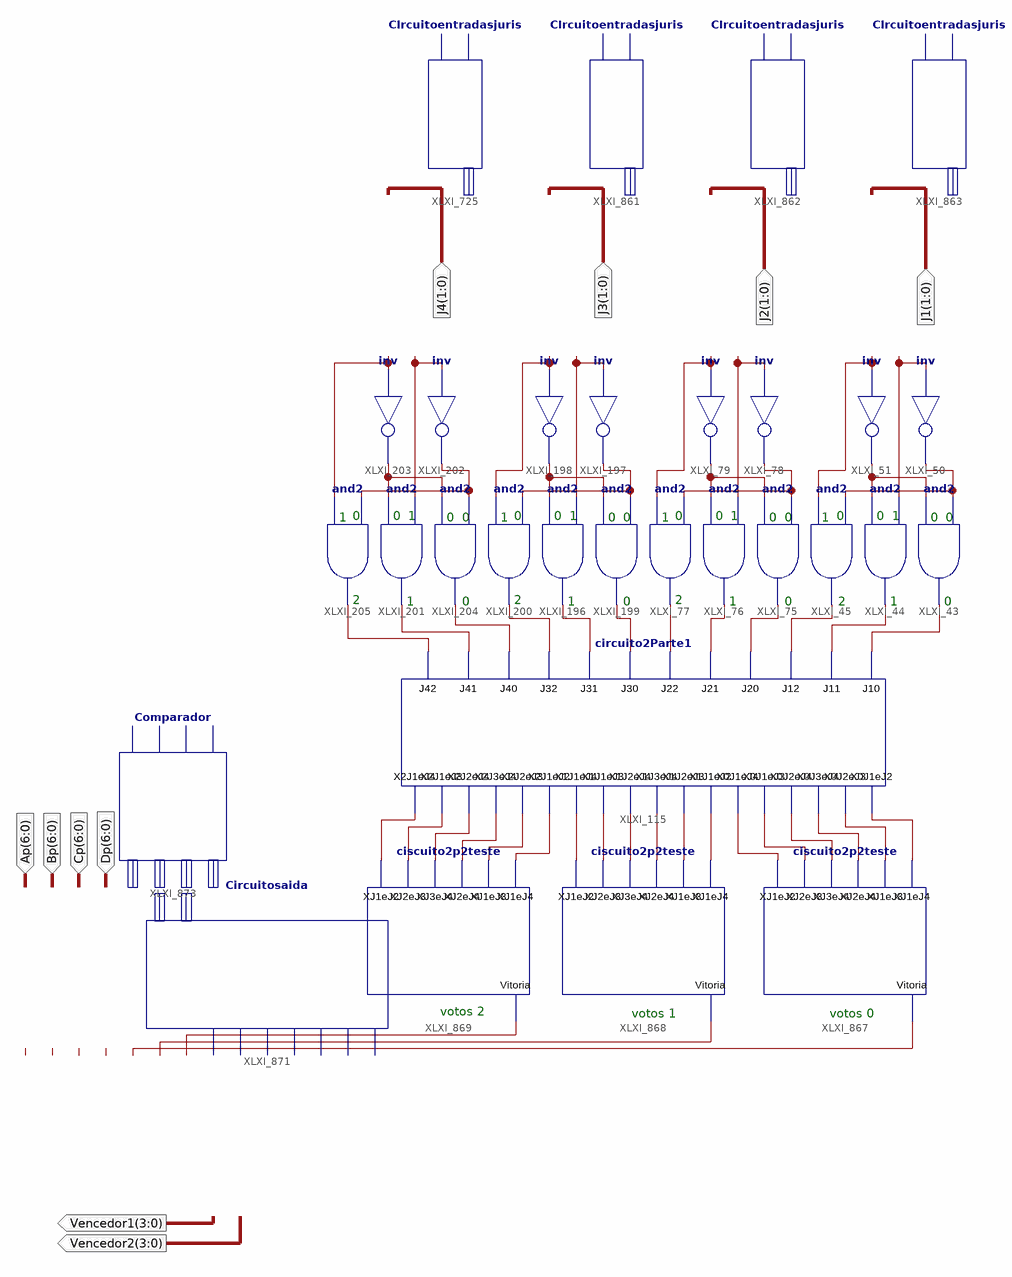
[diagram p0: schematic sheet 1]
// Xilinx ISE schematic CirciutoTotal.sch (spartan6) as structural Verilog: 30 symbols, 10 ports
module CirciutoTotal (
  input  [1:0] J4,
  input  [1:0] J3,
  input  [1:0] J2,
  input  [1:0] J1,
  input  [6:0] Ap,
  input  [6:0] Bp,
  input  [6:0] Cp,
  input  [6:0] Dp,
  output [3:0] Vencedor1,
  output [3:0] Vencedor2
);

  wire J1bit0, J1bit1, J2bit0, J2bit1, J3bit0, J3bit1, XLXN_42, XLXN_43, XLXN_72, XLXN_73, XLXN_145,
       XLXN_146, XLXN_147, XLXN_179, XLXN_180, XLXN_181, XLXN_186, XLXN_187, XLXN_192, XLXN_193, XLXN_196,
       XLXN_197, XLXN_198, XLXN_199, XLXN_200, XLXN_201, XLXN_402, XLXN_403, XLXN_404, XLXN_405, XLXN_406,
       XLXN_407, XLXN_491, XLXN_492, XLXN_493, XLXN_494, XLXN_495, XLXN_496, XLXN_525, XLXN_526, XLXN_527,
       XLXN_528, XLXN_529, XLXN_530, XLXN_1721, XLXN_1723, XLXN_1739, XLXN_1740, XLXN_1741, XLXN_1742,
       XLXN_1744, XLXN_1745, XLXN_1746;

  and XLXI_44 (XLXN_146, XLXN_42, J1bit0);
  not XLXI_50 (XLXN_43, J1bit0);
  not XLXI_51 (XLXN_42, J1bit1);
  and XLXI_45 (XLXN_147, J1bit1, XLXN_43);
  and XLXI_43 (XLXN_145, XLXN_42, XLXN_43);
  and XLXI_76 (XLXN_180, XLXN_72, J2bit0);
  not XLXI_78 (XLXN_73, J2bit0);
  not XLXI_79 (XLXN_72, J2bit1);
  and XLXI_75 (XLXN_179, XLXN_72, XLXN_73);
  and XLXI_77 (XLXN_181, J2bit1, XLXN_73);
  and XLXI_196 (XLXN_197, XLXN_186, J3bit0);
  not XLXI_197 (XLXN_187, J3bit0);
  not XLXI_198 (XLXN_186, J3bit1);
  and XLXI_199 (XLXN_196, XLXN_186, XLXN_187);
  and XLXI_200 (XLXN_198, J3bit1, XLXN_187);
  and XLXI_201 (XLXN_200, XLXN_192, XLXN_1723);
  not XLXI_202 (XLXN_193, XLXN_1723);
  not XLXI_203 (XLXN_192, XLXN_1721);
  and XLXI_204 (XLXN_199, XLXN_192, XLXN_193);
  and XLXI_205 (XLXN_201, XLXN_1721, XLXN_193);
  circuito2Parte1 XLXI_115 (
    .J10(XLXN_145), .J11(XLXN_146), .J12(XLXN_147), .J20(XLXN_179), .J21(XLXN_180), .J22(XLXN_181),
    .J30(XLXN_196), .J31(XLXN_197), .J32(XLXN_198), .J40(XLXN_199), .J41(XLXN_200), .J42(XLXN_201),
    .X0J1eJ2(XLXN_496), .X0J2eJ3(XLXN_495), .X0J3eJ4(XLXN_494), .X0J2eJ4(XLXN_493), .X0J1eJ3(XLXN_492),
    .X0J1eJ4(XLXN_491), .X1J1eJ2(XLXN_530), .X1J2eJ3(XLXN_529), .X1J3eJ4(XLXN_528), .X1J2eJ4(XLXN_527),
    .X1J1eJ3(XLXN_526), .X1J1eJ4(XLXN_525), .X2J1eJ2(XLXN_407), .X2J2eJ3(XLXN_406), .X2J3eJ4(XLXN_405),
    .X2J2eJ4(XLXN_404), .X2J1eJ3(XLXN_403), .X2J1eJ4(XLXN_402));
  CIrcuitoentradasjuris XLXI_725 (.J(J4), .S1(XLXN_1721), .S0(XLXN_1723));
  CIrcuitoentradasjuris XLXI_861 (.J(J3), .S1(J3bit1), .S0(J3bit0));
  CIrcuitoentradasjuris XLXI_862 (.J(J2), .S1(J2bit1), .S0(J2bit0));
  CIrcuitoentradasjuris XLXI_863 (.J(J1), .S1(J1bit1), .S0(J1bit0));
  ciscuito2p2teste XLXI_867 (
    .XJ1eJ4(XLXN_496), .XJ1eJ3(XLXN_495), .XJ2eJ4(XLXN_494), .XJ3eJ4(XLXN_493), .XJ2eJ3(XLXN_492),
    .XJ1eJ2(XLXN_491), .Vitoria(XLXN_1746));
  ciscuito2p2teste XLXI_868 (
    .XJ1eJ4(XLXN_530), .XJ1eJ3(XLXN_529), .XJ2eJ4(XLXN_528), .XJ3eJ4(XLXN_527), .XJ2eJ3(XLXN_526),
    .XJ1eJ2(XLXN_525), .Vitoria(XLXN_1745));
  ciscuito2p2teste XLXI_869 (
    .XJ1eJ4(XLXN_407), .XJ1eJ3(XLXN_406), .XJ2eJ4(XLXN_405), .XJ3eJ4(XLXN_404), .XJ2eJ3(XLXN_403),
    .XJ1eJ2(XLXN_402), .Vitoria(XLXN_1744));
  Circuitosaida XLXI_871 (
    .INA(XLXN_1739), .INB(XLXN_1740), .INC(XLXN_1741), .IND(XLXN_1742), .IN00(XLXN_1746), .IN01(XLXN_1745),
    .IN10(XLXN_1744), .V1(Vencedor1), .V2(Vencedor2));
  Comparador XLXI_873 (
    .BusA(Ap), .BusB(Bp), .BusC(Cp), .BusD(Dp), .A(XLXN_1739), .B(XLXN_1740), .C(XLXN_1741), .D(XLXN_1742));

  // Notes on the sheet:
  //   0
  //   0
  //   1
  //   0
  //   0
  //   1
  //   0
  //   0
  //   1
  //   0
  //   0
  //   1
  //   1
  //   0
  //   0
  //   1
  //   0
  //   0
  //   1
  //   0
  //   0
  //   1
  //   0
  //   0
  //   2
  //   2
  //   2
  //   1
  //   0
  //   1
  //   0
  //   1
  //   0
  //   2
  //   1
  //   0
  //   votos 2
  //   votos 1
  //   votos 0
endmodule
